# Altium schematic sheet CTR-Upper-Main-Board-Rev-A-Leds-1.SchDoc: CTR Controller - Power
size B; Author: TWL; Organization: OLogic, Inc.; DocumentNumber: 112216; Revision: A; SheetNumber: 3; SheetTotal: 4; PageSetup: Record=PageOptions|CenterHorizontal=True|CenterVertical=True|PrintScale=0.70|XCorrection=1.00|YCorrection=1.00|PrintKind=0|BorderSize=5000000|LeftOffset=0|BottomOffset=0|Orientation=2|PaperLength=1000|PaperWidth=1000|Scale=100|PaperSource=15|PrintQuality=600|MediaType=1|DitherType=10|PrintScaleMode=1|PaperKind=Letter|PaperIndex=1
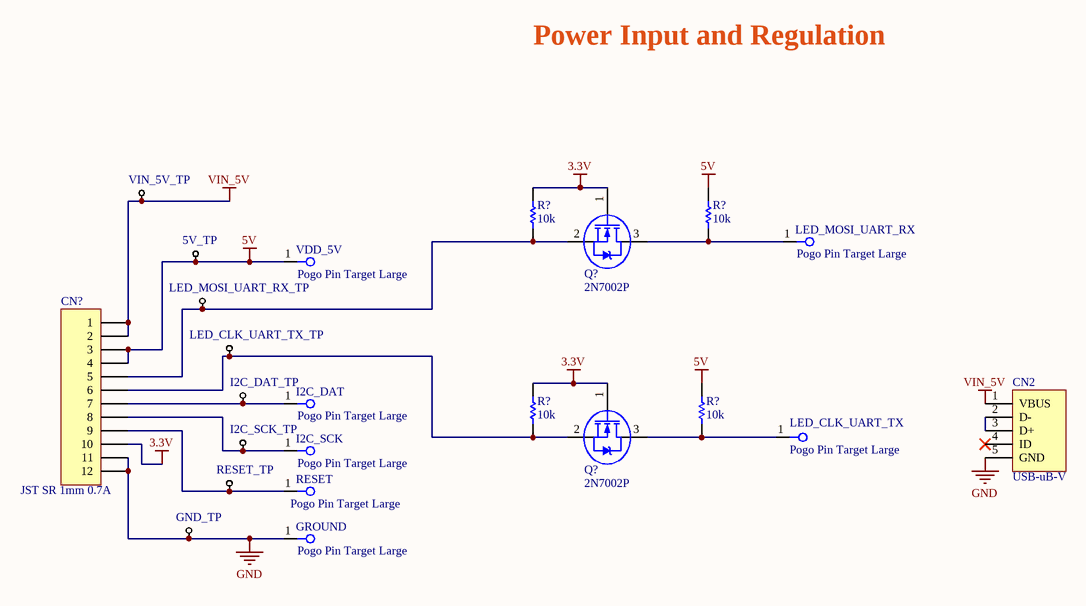
[diagram p0: CTR-Upper-Main-Board-Rev-A-Leds-1.SchDoc]

## Parts
(Parts that share a designator on the sheet are numbered #1, #2 ... from top to bottom, then left to right.)
5V_TP  Test Point  [TestPoint-TH 42 mil]  (value not drawn)
CN2  USB-uB-V  [MOLEX_105133-0011]
CN?  JST SR 1mm 0.7A
GND_TP  Test Point  [TestPoint-TH 42 mil]  (value not drawn)
GROUND  Pogo Pin Target Large  [CTR_POGO_PIN_TARGET]
I2C_DAT  Pogo Pin Target Large  [CTR_POGO_PIN_TARGET]
I2C_DAT_TP  Test Point  [TestPoint-TH 42 mil]  (value not drawn)
I2C_SCK  Pogo Pin Target Large  [CTR_POGO_PIN_TARGET]
I2C_SCK_TP  Test Point  [TestPoint-TH 42 mil]  (value not drawn)
LED_CLK_UART_TX  Pogo Pin Target Large  [CTR_POGO_PIN_TARGET]
LED_CLK_UART_TX_TP  Test Point  [TestPoint-TH 42 mil]  (value not drawn)
LED_MOSI_UART_RX  Pogo Pin Target Large  [CTR_POGO_PIN_TARGET]
LED_MOSI_UART_RX_TP  Test Point  [TestPoint-TH 42 mil]  (value not drawn)
Q?#1  2N7002P  [SOT23]
Q?#2  2N7002P  [SOT23]
R?#1  10K  [RESC0402(1005)_N]
R?#2  10K  [RESC0402(1005)_N]
R?#3  10K  [RESC0402(1005)_N]
R?#4  10K  [RESC0402(1005)_N]
RESET  Pogo Pin Target Large  [CTR_POGO_PIN_TARGET]
RESET_TP  Test Point  [TestPoint-TH 42 mil]  (value not drawn)
VDD_5V  Pogo Pin Target Large  [CTR_POGO_PIN_TARGET]
VIN_5V_TP  Test Point  [TestPoint-TH 42 mil]  (value not drawn)

## Nets
3.3V: CN?.10 Q?#1.1(G) Q?#2.1(G) R?#1.2 R?#3.2
5V: 5V_TP.1 CN?.3 CN?.4 R?#2.2 R?#4.2 VDD_5V.1(A)
GND: CN2.0 CN2.5(GND) CN?.0 CN?.11 CN?.12 GND_TP.1 GROUND.1(A)
VIN_5V: CN2.1(VBUS) CN?.1 CN?.2 VIN_5V_TP.1
NetCN2_2: CN2.2(D-) CN2.3(D+)
NetCN?_5: CN?.5 LED_MOSI_UART_RX_TP.1 Q?#1.2(S) R?#1.1
NetCN?_6: CN?.6 LED_CLK_UART_TX_TP.1 Q?#2.2(S) R?#3.1
NetCN?_7: CN?.7 I2C_DAT.1(A) I2C_DAT_TP.1
NetCN?_8: CN?.8 I2C_SCK.1(A) I2C_SCK_TP.1
NetCN?_9: CN?.9 RESET.1(A) RESET_TP.1
NetLED_CLK_UART_TX_1: LED_CLK_UART_TX.1(A) Q?#2.3(D) R?#4.1
NetLED_MOSI_UART_RX_1: LED_MOSI_UART_RX.1(A) Q?#1.3(D) R?#2.1

Not connected (* = marked no-connect by the designer): CN2 4(ID)*

## Notes on the sheet
- Power Input and Regulation
- Title
- By:
- Date:
- Number:
- Time:
- Revision:
- Sheet
- of
- OLogic, Inc.
- 1394 Borregas Ave.
- Sunnyvale, CA
- 94089 USA
- File:
- (650) 996-1490

## Library data of the parts
5V_TP GND_TP I2C_DAT_TP I2C_SCK_TP LED_CLK_UART_TX_TP LED_MOSI_UART_RX_TP RESET_TP VIN_5V_TP = TestPoint, small: ClassName: IMU
CN2 = USB-MicroB-V: USB, Micro-B, Vertical; Manufacturer: Molex, LLC; Manufacturer Part Number: 1051330001; Number of Contacts: 5; Gender: Receptacle; Specifications: USB 2.0; Number of Ports: 1; Current Rating: 1A, 1.8A; Voltage - Rated: 30VAC; Mating Cycles: 10000; Shielding: Shielded; Material Flammability Rating: UL94 V-0; Supplier 1: Digi-Key; RoHS: RoHS Compliant; Category: Connectors, Interconnects; Stock 1: 35948; Pricing 1: 1=1.06, 10=0.928, 25=0.8732, 50=0.837, 100=0.8005, 250=0.72776 (USD); Packaging: Cut Tape (CT); Part Status: Active; Connector Type: USB - micro B; Mounting Type: Surface Mount; Mounting Feature: Vertical; Termination: Solder; Features: Pick and Place; Ingress Protection: -; Operating Temperature: -35°C ~ 85°C; Contact Finish: Gold; Shell/Shielding Material: Steel, Stainless; Insulation Color: Black; ComponentLink1URL: http://www.molex.com/pdm_docs/sd/1051330001_sd.pdf; ComponentLink1Description: http://www.molex.com/pdm_docs/sd/1051330001_sd.pdf; Supplier Part Number 1: WM9734CT-ND
CN? = JST-BM12B-SRSS-TB(LF)(SN): 12 Positions Header Connector 0.039" (1.00mm) Surface Mount Tin; Manufacturer: Japan Solderless Terminals (JST); No of Positions: 12; Style/Orientation: Straight Header/Plug; Supplier 1: Digikey; Manufacturer Part Number: BM12B-SRSS-TB(LF)(SN); Stock 1: 22152; Pricing 1: 1=1.2, 10=1.056, 100=0.9107, 500=0.7451 (USD); Pitch: 1 mm; Type: Wire to Board; Termination: Crimp; ComponentLink1URL: https://datasheet.ciiva.com/16420/bm12b-srss-tblfsn-16420661.pdf; ComponentLink1Description: https://datasheet.ciiva.com/16420/bm12b-srss-tblfsn-16420661.pdf; ComponentLink2URL: https://datasheet.ciiva.com/730/esr-730620.pdf; ComponentLink2Description: https://datasheet.ciiva.com/730/esr-730620.pdf; ComponentLink3URL: https://datasheet.ciiva.com/712/esr-712686.pdf; ComponentLink3Description: https://datasheet.ciiva.com/712/esr-712686.pdf; ComponentLink4URL: https://datasheet.ciiva.com/712/esr-712687.pdf; ComponentLink4Description: https://datasheet.ciiva.com/712/esr-712687.pdf; Supplier Part Number 1: 455-1798-1-ND
GROUND I2C_DAT I2C_SCK LED_CLK_UART_TX LED_MOSI_UART_RX RESET VDD_5V = CTR Pogo Pin Target Large: Manufacturer Part Number 1: Large Target; Plating: Gold; Category: Connectors, Interconnects; Part Status: Active; Material: Copper Alloy; Mounting Type: Through Hole; Manufacturer 1: CTR; Supplier Unit Price 1: 0.15; Supplier 1: CTR; Supplier Part Number 1: Large Target; Supplier Stock 1: 9999999
Q?#1 Q?#2 = 2N7002P: MOSFET N-CH 60V 0.36A SOT-23; Manufacturer: NXP Semiconductors; Manufacturer Part Number: 2N7002P,235; FET Type: MOSFET N-Channel, Metal Oxide; FET Feature: Logic Level Gate; Current - Continuous Drain (Id) @ 25°C: 360mA (Ta); Rds On (Max) @ Id, Vgs: 1.6 Ohm @ 500mA, 10V; Vgs(th) (Max) @ Id: 2.4V @ 250µA; Gate Charge (Qg) @ Vgs: 0.8nC @ 4.5V; Input Capacitance (Ciss) @ Vds: 50pF @ 10V; Power - Max: 350mW; Supplier 1: Digi-Key; RoHS: RoHS Compliant; Category: Discrete Semiconductor Products; Stock 1: 4190; Pricing 1: 1=0.15, 10=0.135, 25=0.1224, 100=0.0881, 250=0.05188, 500=0.04304, 1000=0.02936, 2500=0.02498, 5000=0.02252 (USD); Packaging: Cut Tape (CT); Drain to Source Voltage (Vdss): 60V; Mounting Type: Surface Mount; Package / Case: TO-236-3, SC-59, SOT-23-3; Supplier Device Package: SOT-23 (TO-236AB); ComponentLink1URL: http://www.nxp.com/documents/data_sheet/2N7002P.pdf; ComponentLink1Description: http://www.nxp.com/documents/data_sheet/2N7002P.pdf; Supplier Part Number 1: 568-11588-1-ND; ClassName: power
R?#1-R?#4 = RES 10K OHM 1% 1/10W 0402: 10K 0402; Manufacturer: Panasonic Electronic Components; Manufacturer Part Number: ERJ-2RKF1002X; Tolerance: ±1%; Power (Watts): 0.1W, 1/10W; Temperature Coefficient: ±100ppm/°C; ClassName: power; Supplier 1: Digi-Key; RoHS: RoHS Compliant; Category: Resistors; Stock 1: 8784573; Pricing 1: 1=0.1, 50=0.0196, 100=0.0149, 250=0.01104, 500=0.00816, 1000=0.00544, 5000=0.00383 (USD); Packaging: Cut Tape (CT); Composition: Thick Film; Features: Automotive AEC-Q200; Operating Temperature: -55°C ~ 155°C; Package / Case: 0402 (1005 Metric); Supplier Device Package: 0402; Size / Dimension: 0.039" L x 0.020" W (1.00mm x 0.50mm); Height: 0.016" (0.40mm); Number of Terminations: 2; ComponentLink1URL: http://industrial.panasonic.com/www-cgi/jvcr13pz.cgi?E+PZ+3+AOA0002+ERJ2RKF1002X+7+WW; ComponentLink1Description: http://industrial.panasonic.com/www-cgi/jvcr13pz.cgi?E+PZ+3+AOA0002+ERJ2RKF1002X+7+WW; Supplier Part Number 1: P10.0KLCT-ND; Creator: osman; Resistance (Ohms): 10k